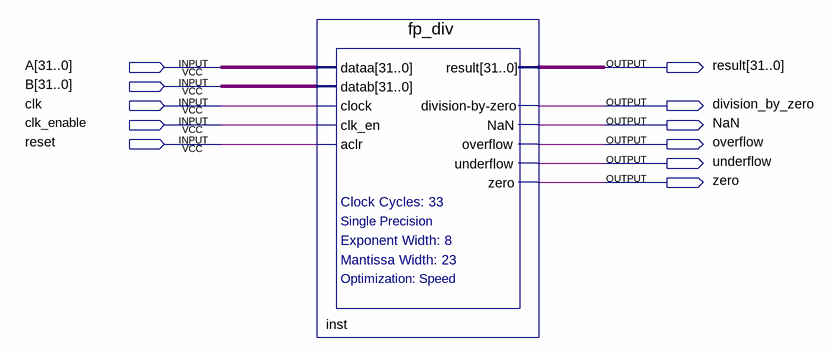
[diagram p0: schematic sheet]
// Quartus schematic fp_div.bdf as structural Verilog: 1 symbols, 11 pins
module fp_div (
  input  [31:0] A,
  input  [31:0] B,
  input  clk,
  input  clk_enable,
  input  reset,
  output [31:0] result,
  output division_by_zero,
  output NaN,
  output overflow,
  output underflow,
  output zero
);

  fp_div inst (
    .dataa(A), .datab(B), .clock(clk), .clk_en(clk_enable), .aclr(reset), .result(result),
    .\division-by-zero (division_by_zero), .NaN(NaN), .overflow(overflow), .underflow(underflow), .zero(zero));
endmodule
